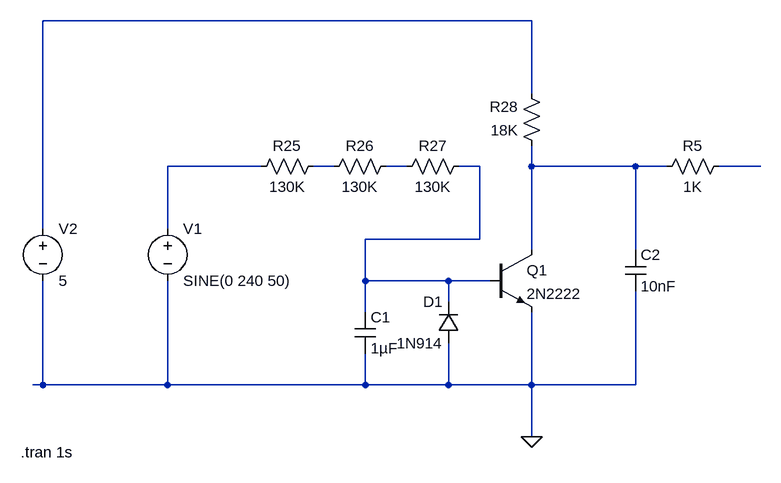
[diagram p0: schematic phase_sync.asc]
phase_sync.asc, the LTspice schematic file:
Version 4
SHEET 1 880 680
WIRE 176 -240 -576 -240
WIRE 176 -128 176 -240
WIRE -240 -16 -384 -16
WIRE -128 -16 -160 -16
WIRE -16 -16 -48 -16
WIRE 96 -16 64 -16
WIRE 176 -16 176 -48
WIRE 336 -16 176 -16
WIRE 384 -16 336 -16
WIRE 528 -16 464 -16
WIRE -576 80 -576 -240
WIRE -384 80 -384 -16
WIRE 96 96 96 -16
WIRE 96 96 -80 96
WIRE 176 112 176 -16
WIRE 336 112 336 -16
WIRE -80 160 -80 96
WIRE 48 160 -80 160
WIRE 112 160 48 160
WIRE 48 192 48 160
WIRE -80 208 -80 160
WIRE -576 320 -576 160
WIRE -576 320 -592 320
WIRE -384 320 -384 160
WIRE -384 320 -576 320
WIRE -80 320 -80 272
WIRE -80 320 -384 320
WIRE 48 320 48 256
WIRE 48 320 -80 320
WIRE 176 320 176 208
WIRE 176 320 48 320
WIRE 336 320 336 176
WIRE 336 320 176 320
WIRE 176 400 176 320
FLAG 176 400 0
SYMBOL npn 112 112 R0
SYMATTR InstName Q1
SYMATTR Value 2N2222
SYMBOL diode 64 256 R180
WINDOW 0 24 64 Left 2
WINDOW 3 24 0 Left 2
SYMATTR InstName D1
SYMATTR Value 1N914
SYMBOL cap -96 208 R0
SYMATTR InstName C1
SYMATTR Value 1µF
SYMBOL cap 320 112 R0
SYMATTR InstName C2
SYMATTR Value 10nF
SYMBOL res -144 -32 R90
WINDOW 0 0 56 VBottom 2
WINDOW 3 32 56 VTop 2
SYMATTR InstName R25
SYMATTR Value 130K
SYMBOL res -32 -32 R90
WINDOW 0 0 56 VBottom 2
WINDOW 3 32 56 VTop 2
SYMATTR InstName R26
SYMATTR Value 130K
SYMBOL res 80 -32 R90
WINDOW 0 0 56 VBottom 2
WINDOW 3 32 56 VTop 2
SYMATTR InstName R27
SYMATTR Value 130K
SYMBOL res 192 -32 R180
WINDOW 0 36 76 Left 2
WINDOW 3 36 40 Left 2
SYMATTR InstName R28
SYMATTR Value 18K
SYMBOL res 368 0 R270
WINDOW 0 32 56 VTop 2
WINDOW 3 0 56 VBottom 2
SYMATTR InstName R5
SYMATTR Value 1K
SYMBOL voltage -384 64 R0
WINDOW 123 0 0 Left 0
WINDOW 39 0 0 Left 0
SYMATTR InstName V1
SYMATTR Value SINE(0 240 50)
SYMBOL voltage -576 64 R0
WINDOW 123 0 0 Left 0
WINDOW 39 0 0 Left 0
SYMATTR InstName V2
SYMATTR Value 5
TEXT -610 424 Left 2 !.tran 1s

The netlist it stands for:
* phase_sync.asc
Q1 N006 N005 0 0 2N2222
D1 0 N005 1N914
C1 N005 0 1µF
C2 N006 0 10nF
R25 N003 N002 130K
R26 N004 N003 130K
R27 N005 N004 130K
R28 N006 N001 18K
R5 N006 N007 1K
V1 N002 0 SINE(0 240 50)
V2 N001 0 5
.model D D
.lib standard.dio
.model NPN NPN
.model PNP PNP
.lib standard.bjt
.tran 1s
.backanno
.end